# EAGLE design ltc2934_platine (EAGLE 9.6.2)
AUTHOR: Tobias Poppe; DOC_NR: 1; REV: 1.0
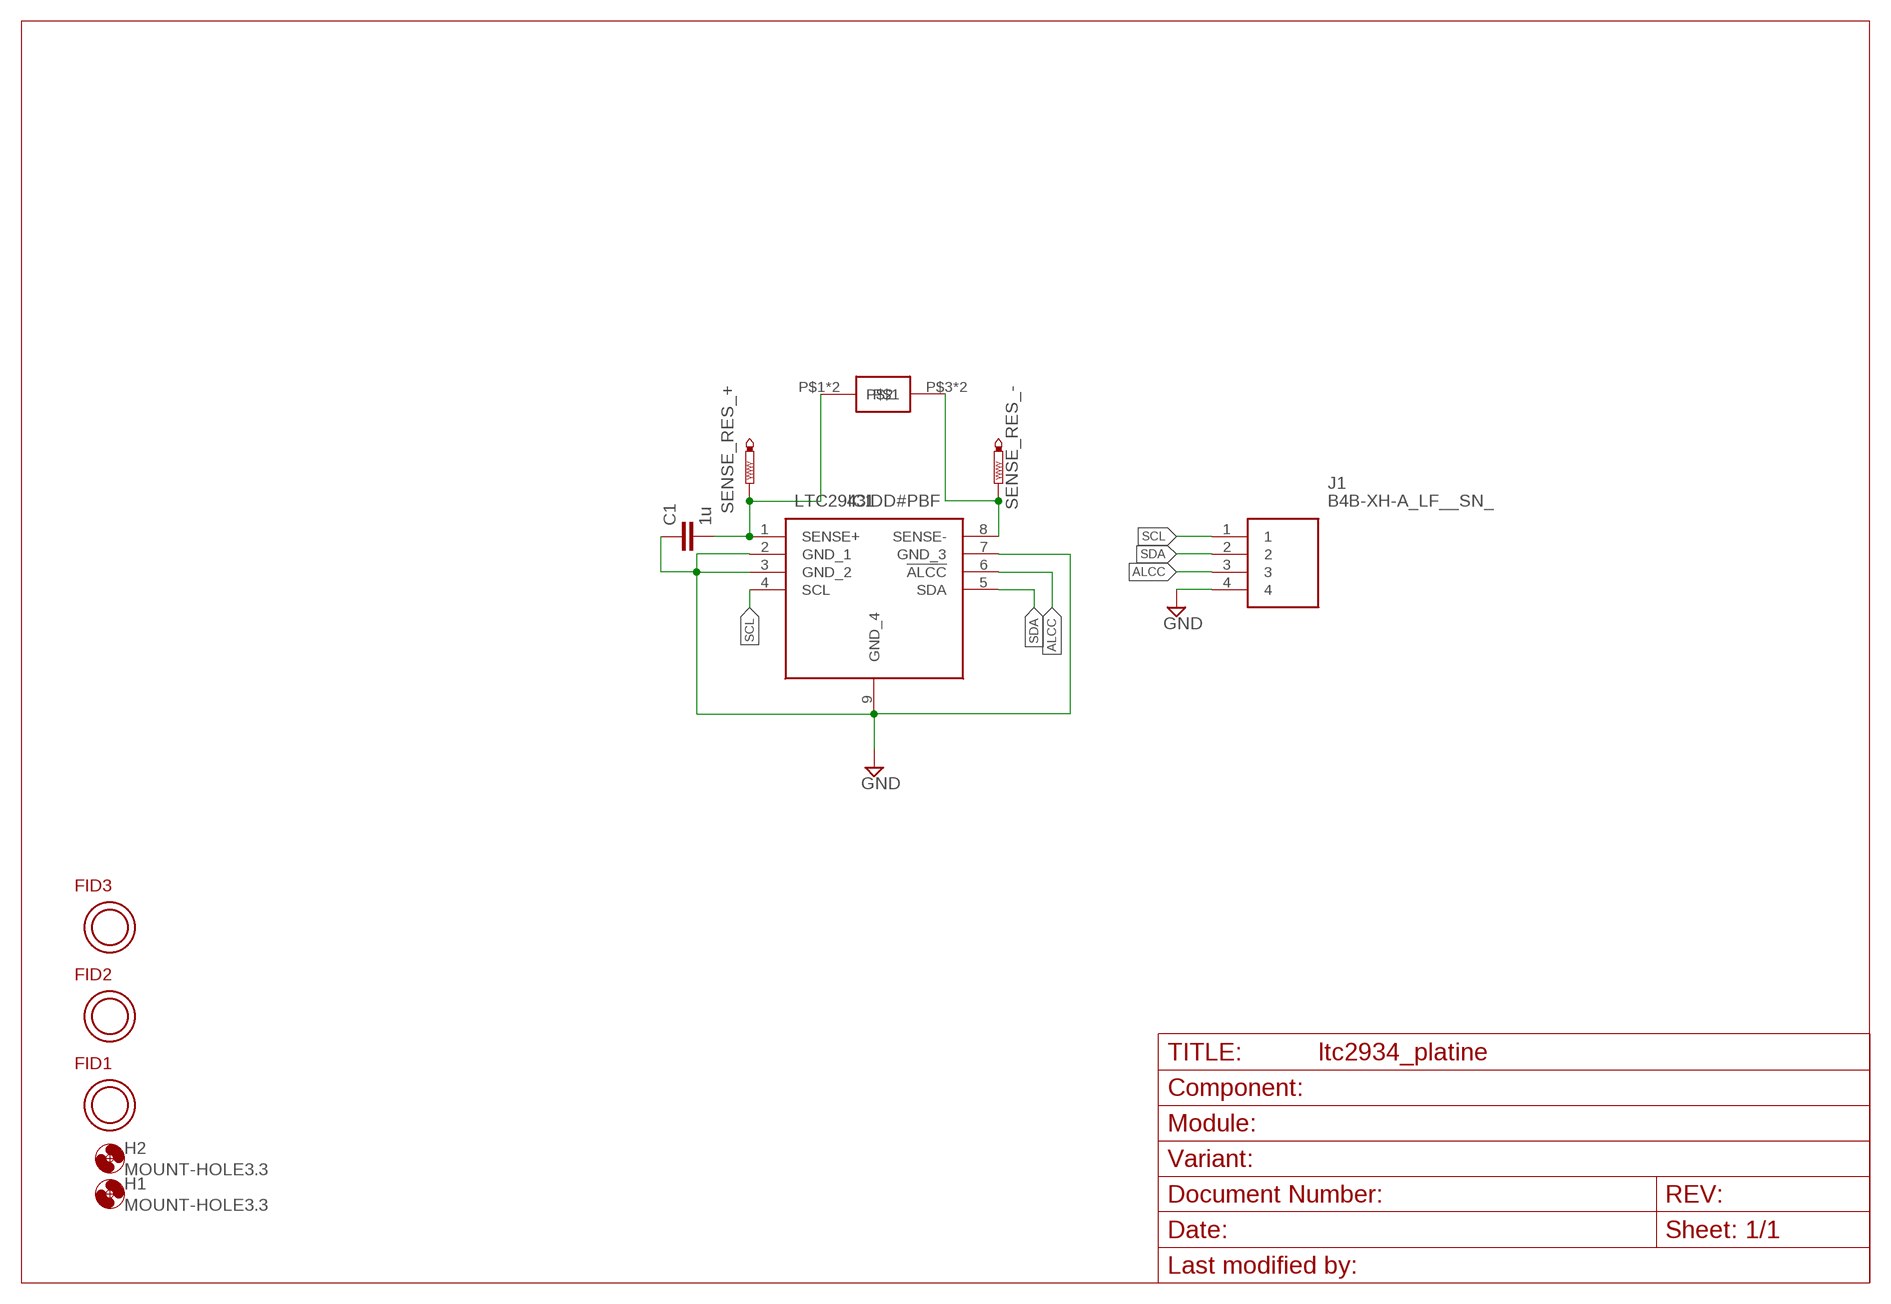
[diagram p0: schematic, sheet 1]

## Parts
C1  1u  C-EUC1206  [C1206]
FID1  OPEN-PNP-FIDUCIAL  [OPEN-PNP-FIDUCIAL]
FID2  OPEN-PNP-FIDUCIAL  [OPEN-PNP-FIDUCIAL]
FID3  OPEN-PNP-FIDUCIAL  [OPEN-PNP-FIDUCIAL]
H1  MOUNT-HOLE3.3  [3,3]
H2  MOUNT-HOLE3.3  [3,3]
IC1  LTC2943IDD#PBF  [SON50P300X300X80-9N]
J1  B4B-XH-A_LF__SN_  [B4BXHALFSN]
SENSE_RES_+  PTR1PAD1-13Y  [P1-13Y]
SENSE_RES_-  PTR1PAD1-13Y  [P1-13Y]
U$1  SHUNT_50A_75MV  [SHUNT_50A_75MV]

## Nets
ALCC: IC1.6(!ALCC) J1.3
GND: C1.1 IC1.2(GND_1) IC1.3(GND_2) IC1.7(GND_3) IC1.9(GND_4) J1.4
SCL: IC1.4(SCL) J1.1
SDA: IC1.5(SDA) J1.2
SENSE+: C1.2 IC1.1(SENSE+) SENSE_RES_+.TP U$1.P$1 U$1.P$6
SENSE_-: IC1.8(SENSE-) SENSE_RES_-.TP U$1.P$3 U$1.P$5

## Library data of the parts
C1 = rcl:C-EU: CAPACITOR, European symbol
FID1-FID3 = topo-eng:OPEN-PNP-FIDUCIAL
H1 H2 = holes:MOUNT-HOLE: MOUNTING HOLE with drill center marker
IC1 = samacsys:LTC2943IDD#PBF: Multicell Battery Gas Gauge with Temperature, Voltage and Current Measurement Source: Datasheet <http://cds.linear.com/docs/en/datasheet/2943fa.pdf>; ARROW_PART_NUMBER: LTC2943IDD#PBF; ARROW_PRICE-STOCK: https://www.arrow.com/en/products/ltc2943iddpbf/linear-technology; DESCRIPTION: Multicell Battery Gas Gauge with Temperature, Voltage and Current Measurement; HEIGHT: 0.8mm; MANUFACTURER_NAME: Linear Technology; MANUFACTURER_PART_NUMBER: LTC2943IDD#PBF; MOUSER_PART_NUMBER: 584-LTC2943IDD#PBF; MOUSER_PRICE-STOCK: https://www.mouser.co.uk/ProductDetail/Analog-Devices-Linear-Technology/LTC2943IDDPBF?qs=hVkxg5c3xu%2FUqCX%252BBXGPHA%3D%3D
J1 = samacsys:B4B-XH-A_LF__SN_: CONN HEADER VERT 4POS 2.5MM Source: Datasheet <https://datasheet.lcsc.com/szlcsc/JST-Sales-America-B4B-XH-A-LF-SN_C144395.pdf>; ARROW_PART_NUMBER: B4B-XH-A(LF)(SN); ARROW_PRICE-STOCK: https://www.arrow.com/en/products/b4b-xh-a-lf-sn/jst-manufacturing; DESCRIPTION: CONN HEADER VERT 4POS 2.5MM; HEIGHT: 7mm; MANUFACTURER_NAME: JST (JAPAN SOLDERLESS TERMINALS); MANUFACTURER_PART_NUMBER: B4B-XH-A(LF)(SN)
SENSE_RES_+ SENSE_RES_- = testpad:PTR1: TEST PIN
U$1 = topo-eng:SHUNT_50A_75MV

## Board
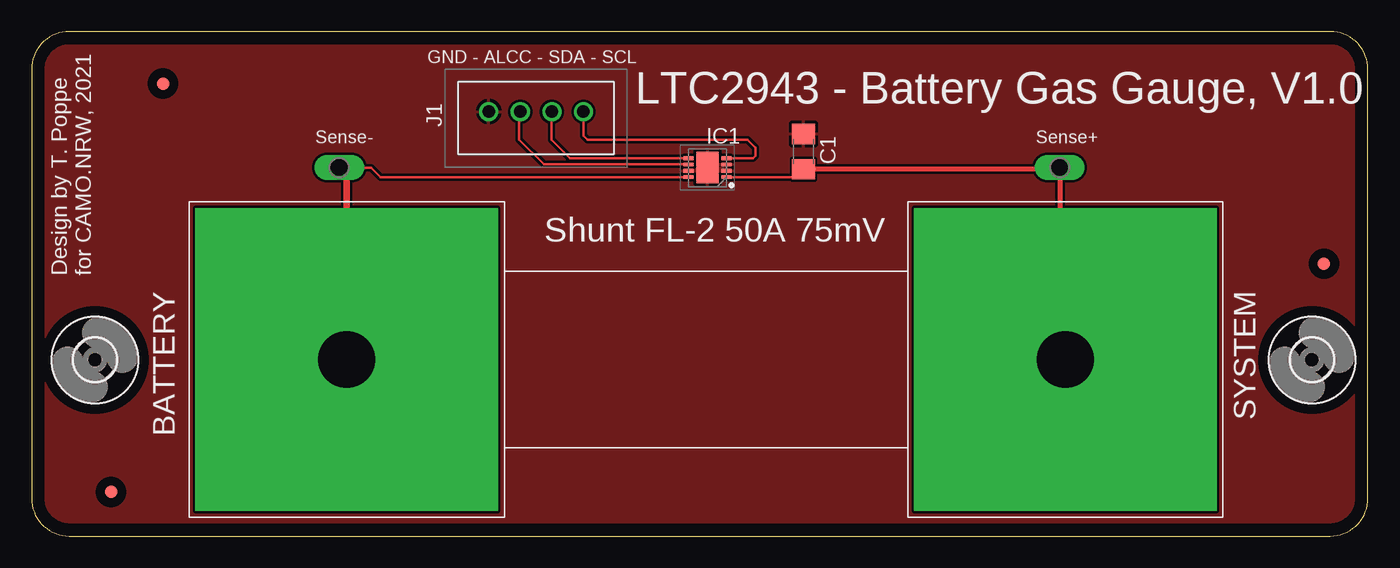
[diagram p1: board, top side]
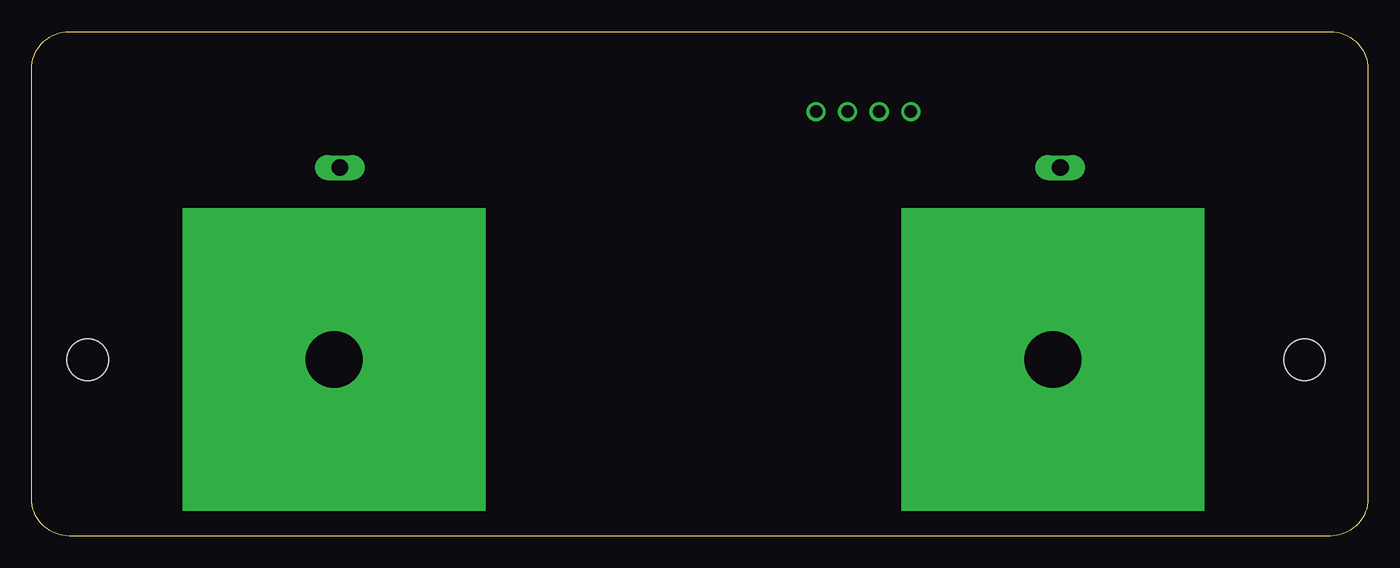
[diagram p2: board, bottom side, seen from below]

Size 106 x 40 mm. Coordinates in mm from the lower left corner, seen from the top.
Outline: 3,0 103,0 arc90 106,3 106,37 arc90 103,40 3,40 arc90 0,37 0,3 arc90 3,0
Copper layers (1*16): Top 0.035mm / dielectric 1.5mm / Bottom 0.035mm
Design rules "default": minimum track width 6mil, minimum drill 0.35mm, track to track 6mil, track to pad 6mil, pad to pad 6mil, via to via 6mil, smd to smd 6mil, copper to edge 40mil, drill to drill 6mil, minimum pad ring 10mil, minimum via ring 8mil, stop-mask expansion 4mil, vias tented up to drill 0mil, thermal gap 10mil

### Footprints (pad centres in the part's own frame; a part is rotated, then mirrored left to right if it is on the bottom)
C1206 = smd 1.6 x 1.8: 1 -1.4,0; 2 1.4,0
OPEN-PNP-FIDUCIAL = smd 1 x 1: FID$1 0,0
3,3 = hole 3.3: 0,0
SON50P300X300X80-9N = smd 0.8 x 0.3: 1 -1.5,0.75; 2 -1.5,0.25; 3 -1.5,-0.25; 4 -1.5,-0.75; 5 1.5,-0.75; 6 1.5,-0.25; 7 1.5,0.25; 8 1.5,0.75 | smd 1.75 x 2.48: 9 0,0
B4BXHALFSN = drill 1 pad 1.5: 1 0,0; 2 2.5,0; 3 5,0; 4 7.5,0
P1-13Y = drill 1.321 pad 1.905 long: TP 0,0
SHUNT_50A_75MV = drill 4.5 pad 24 square: P$1 68,11; P$3 11,11 | smd 8 x 8 bottom: P$5 11,11; P$6 68,11

### Placement (x,y rotation side)
C1  61.23,30.48 270 top
FID1  10.43,35.88 0 top
FID2  6.3,3.49 0 top
FID3  102.5,21.59 0 top
H1  5.03,13.97 0 top
H2  101.55,13.97 0 top
IC1  53.61,29.21 180 top
J1  43.77,33.66 180 top
SENSE_RES_+  81.55,29.21 90 top
SENSE_RES_-  24.4,29.21 90 top
U$1  14,3 0 top

### Tracks (layer width: path | path; a pad name or v marks a point on that pad's centre or on a via)
ALCC
  Top 0.2: IC1.6 40.66,29.46 38.69,31.43 38.69,33.58 J1.3
GND
  pour Top (isolate 0.2): -2.27,40.64 109.49,40.64 109.49,-1.27 -2.27,-1.27
SCL
  Top 0.2: IC1.4 57.22,29.96 57.42,30.16 57.42,30.8 56.78,31.43 44.09,31.43 43.77,31.75 J1.1
SDA
  Top 0.2: IC1.5 42.7,29.96 41.23,31.43 41.23,33.62 J1.2
SENSE+
  Top 0.2: IC1.1 60.61,28.46 C1.2
  Top 0.406: U$1.P$1 81.55,14.45 SENSE_RES_+.TP 81.42,29.08 C1.2
SENSE_-
  Top 0.2: IC1.8 27.69,28.46 26.94,29.21 25,29.21
  Top 0.508: U$1.P$3 25,29.21 SENSE_RES_-.TP

### Text on the board
tPlace: GND - ALCC - SDA - SCL | LTC2943 - Battery Gas Gauge, V1.0 | Sense- | Sense+ | Design by T. Poppe / for CAMO.NRW, 2021 | SYSTEM | BATTERY